# EAGLE schematic rotor (EAGLE 9.6.2)
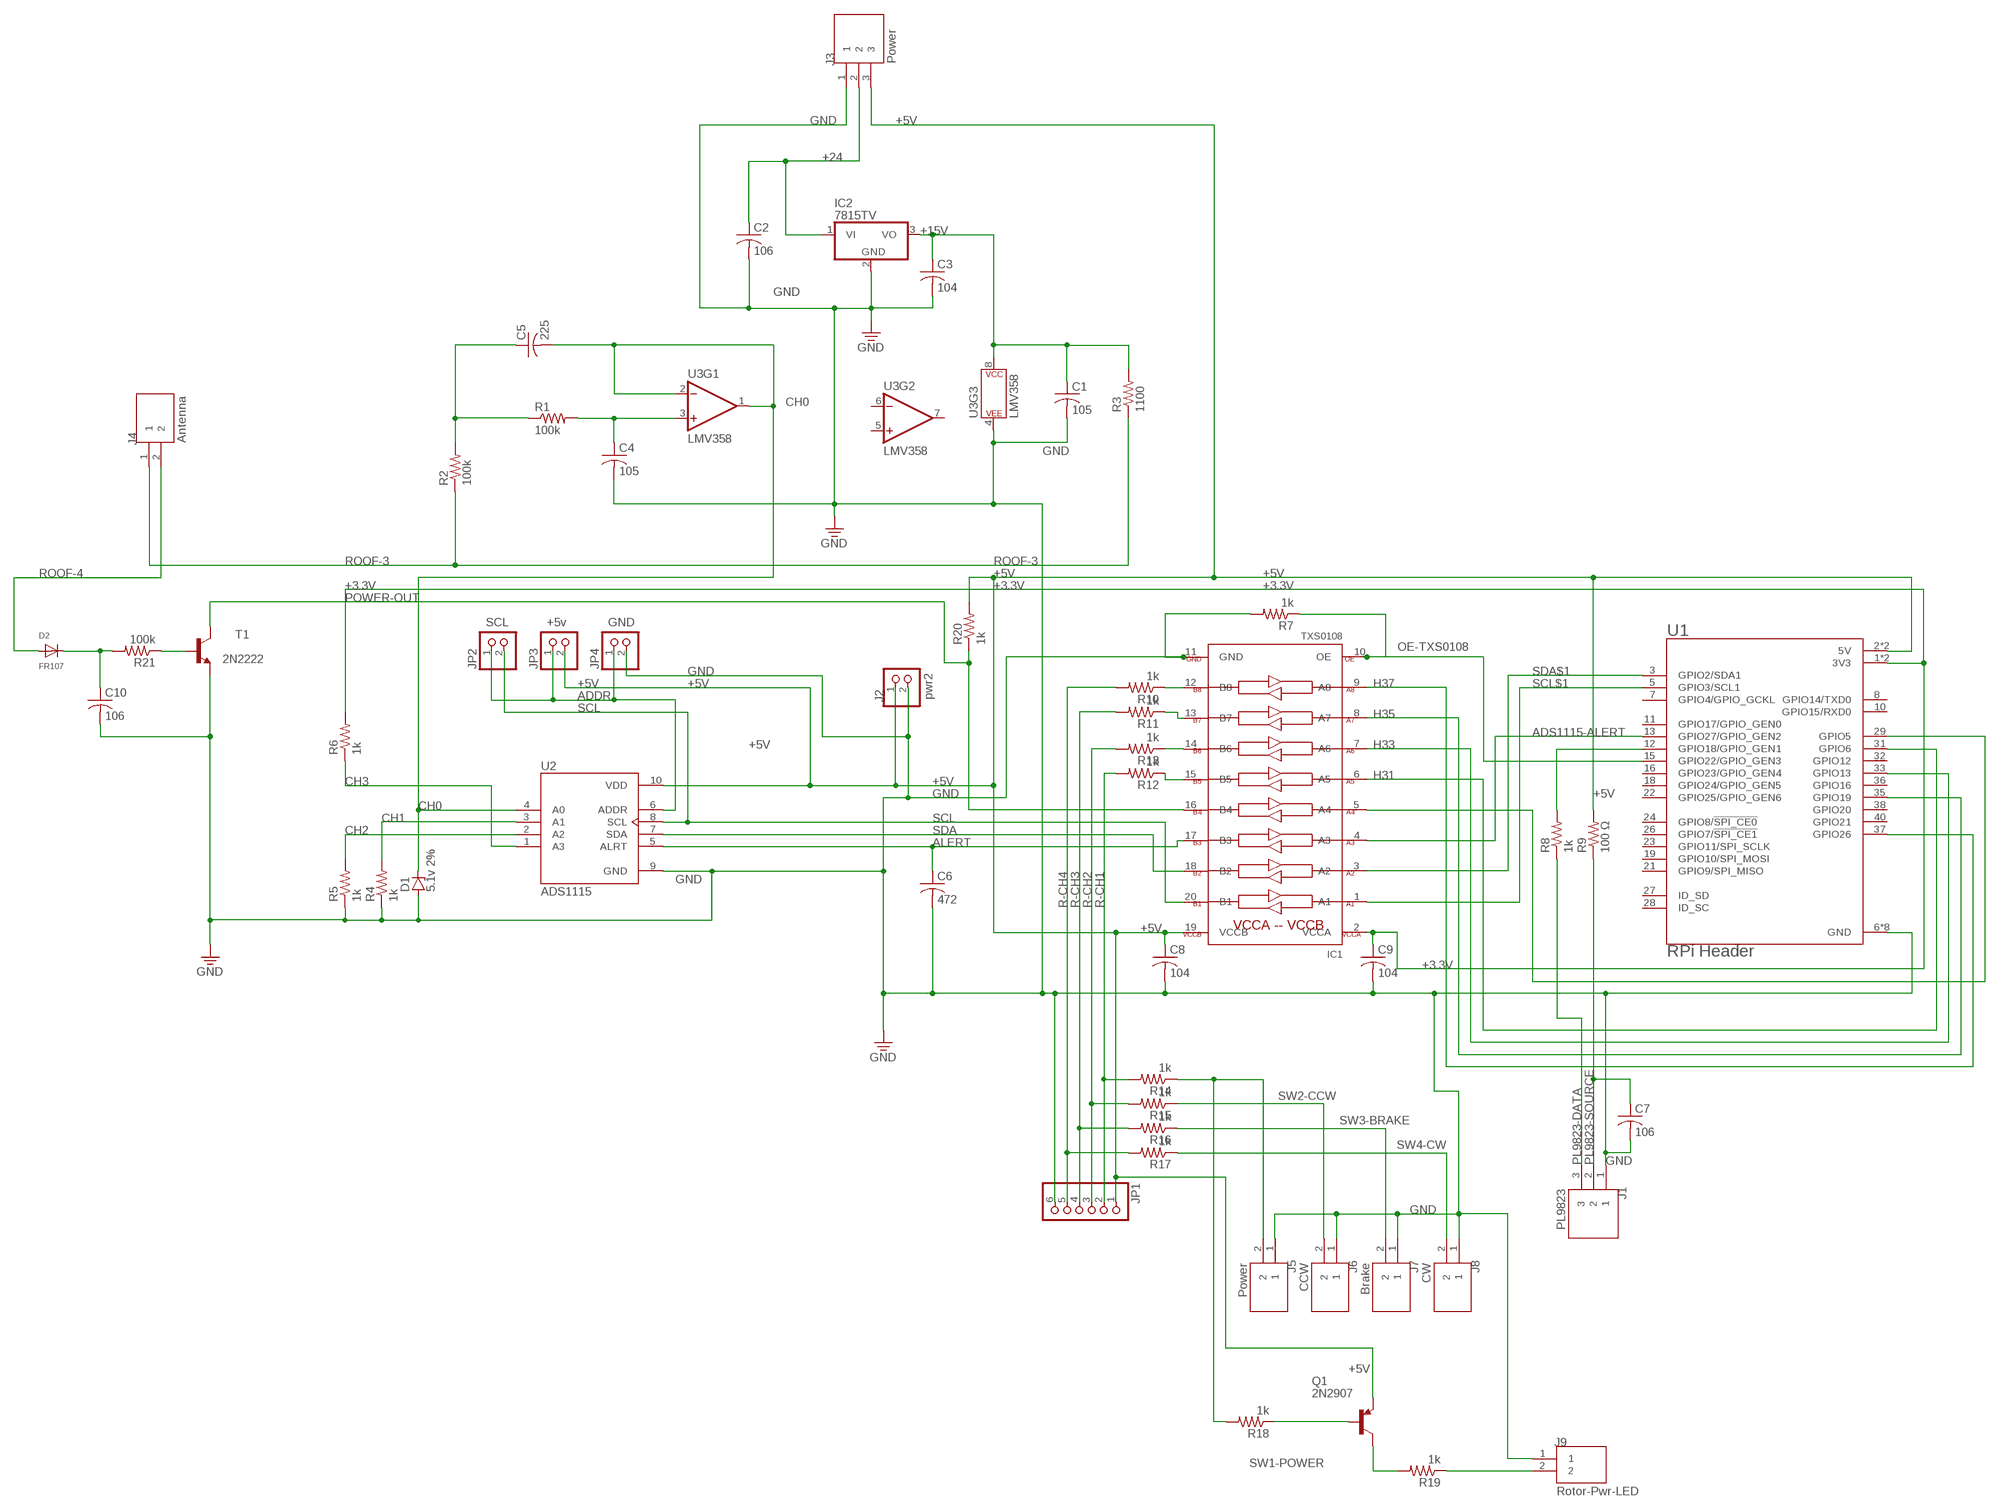
[diagram p0: schematic, sheet 1]

## Parts
C1  105  C-USC0805  [C0805]
C2  106  C-USC0805  [C0805]
C3  104  C-USC0805  [C0805]
C4  105  C-USC0805  [C0805]
C5  225  C-USC0805  [C0805]
C6  472  C-USC0805  [C0805]
C7  106  C-USC0805  [C0805]
C8  104  C-USC0805  [C0805]
C9  104  C-USC0805  [C0805]
C10  106  C-USC0805  [C0805]
D1  5.1v 2%  ZENER-DIODEZD-7.5  [ZDIO-7.5]
D2  FR107  DIODESMA  [SMADIODE]
IC1  TXS0108  TXS0108EPWR  [TSSOP20]
IC2  7815TV  [TO220V]
J1  PL9823  TB004-508-03BE  [CUI_TB004-508-03BE]
J2  pwr2  PINHD-1X2  [1X02]
J3  Power  TB004-508-03BE  [CUI_TB004-508-03BE]
J4  Antenna  TB004-508-02BE  [CUI_TB004-508-02BE]
J5  Power  TB004-508-02BE  [CUI_TB004-508-02BE]
J6  CCW  TB004-508-02BE  [CUI_TB004-508-02BE]
J7  Brake  TB004-508-02BE  [CUI_TB004-508-02BE]
J8  CW  TB004-508-02BE  [CUI_TB004-508-02BE]
J9  Rotor-Pwr-LED  TB004-508-02BE  [CUI_TB004-508-02BE]
JP1  PINHD-1X6  [1X06]
JP2  SCL  PINHD-1X2SPECIAL  [1X02-SPECIAL]
JP3  +5v  PINHD-1X2SPECIAL  [1X02-SPECIAL]
JP4  GND  PINHD-1X2SPECIAL  [1X02-SPECIAL]
Q1  2N2907  [TO92-EBC-OVAL]
R1  100k  R-US_M0805  [M0805]
R2  100k  R-US_M0805  [M0805]
R3  1100  R-US_0204/7  [0204/7]
R4  1k  R-US_M0805  [M0805]
R5  1k  R-US_M0805  [M0805]
R6  1k  R-US_M0805  [M0805]
R7  1k  R-US_M0805  [M0805]
R8  1k  R-US_M0805  [M0805]
R9  100 Ω  R-US_M0805  [M0805]
R10  1k  R-US_M0805  [M0805]
R11  1k  R-US_M0805  [M0805]
R12  1k  R-US_M0805  [M0805]
R13  1k  R-US_M0805  [M0805]
R14  1k  R-US_M0805  [M0805]
R15  1k  R-US_M0805  [M0805]
R16  1k  R-US_M0805  [M0805]
R17  1k  R-US_M0805  [M0805]
R18  1k  R-US_M0805  [M0805]
R19  1k  R-US_M0805  [M0805]
R20  1k  R-US_M0805  [M0805]
R21  100k  R-US_M0805  [M0805]
T1  2N2222  [TO92-EBC-OVAL]
U1  RPi Header  RASPBERRY_PI_3B+_HDRMODEL_RASPBEERY_PI_3B_HDR  [MODULE_RASPBERRY_PI_3B+_HDR]
U2  ADS1115  ADS1115-BREAKOUT-NARROW  [MODULE_1115_NARROW]
U3  LMV358  LM358-SOP8SOIC  [SO08]

## Nets
+3.3V: C9.1 IC1.2(VCCA) R6.2 U1.1(3V3) U1.17(3V3)
+5V: C8.1 IC1.19(VCCB) J2.1 J3.3 JP1.1 JP3.2 Q1.E R9.2 R20.2 U1.2(5V) U1.4(5V) U2.10(VDD)
+15V: C1.1 C3.1 IC2.3(VO) R3.2 U3.8(P$V+)
+24: C2.1 IC2.1(VI) J3.2
ADDR: JP2.1 JP3.1 JP4.1 U2.6(ADDR)
ADS1115-ALERT: IC1.4(A3) U1.13(GPIO27/GPIO_GEN2)
ALERT: C6.1 IC1.17(B3) U2.5(ALRT)
CH0: C5.2 D1.C U2.4(A0) U3.1(OUT) U3.2(-IN)
CH1: R4.2 U2.3(A1)
CH2: R5.2 U2.2(A2)
CH3: R6.1 U2.1(A3)
GND: C1.2 C2.2 C3.2 C4.2 C6.2 C7.2 C8.2 C9.2 C10.2 D1.A IC1.11(GND) IC2.2(GND) J1.1 J2.2 J3.1 J5.1 J6.1 J7.1 J8.1 J9.1 JP1.6 JP4.2 R4.1 R5.1 R7.2 T1.E U1.6(GND) U1.9(GND) U1.14(GND) U1.20(GND) U1.25(GND) U1.30(GND) U1.34(GND) U1.39(GND) U2.9(GND) U3.4(P$V-)
H31: IC1.6(A5) U1.31(GPIO6)
H33: IC1.7(A6) U1.33(GPIO13)
H35: IC1.8(A7) U1.35(GPIO19)
H37: IC1.9(A8) U1.37(GPIO26)
N$1: C4.1 R1.2 U3.3(+IN)
N$2: R8.2 U1.12(GPIO18/GPIO_GEN1)
N$3: C5.1 R1.1 R2.2
N$4: IC1.15(B5) R12.1
N$5: IC1.14(B6) R13.1
N$6: IC1.13(B7) R11.1
N$7: IC1.12(B8) R10.1
N$8: Q1.C R19.2
N$9: Q1.B R18.1
N$10: IC1.5(A4) U1.29(GPIO5)
N$11: C10.1 D2.C R21.2
N$12: R21.1 T1.B
OE-TXS0108: IC1.10(OE) R7.1 U1.15(GPIO22/GPIO_GEN3)
PL9823-DATA: J1.3 R8.1
PL9823-SOURCE: C7.1 J1.2 R9.1
POWER-OUT: IC1.16(B4) R20.1 T1.C
R-CH1: JP1.2 R12.2 R14.2
R-CH2: JP1.3 R13.2 R15.2
R-CH3: JP1.4 R11.2 R16.2
R-CH4: JP1.5 R10.2 R17.2
ROOF-3: J4.1 R2.1 R3.1
ROOF-4: D2.A J4.2
ROTOR-PWR-LED-SOURCE: J9.2 R19.1
SCL: IC1.20(B1) JP2.2 U2.8(SCL)
SCL$1: IC1.1(A1) U1.5(GPIO3/SCL1)
SDA: IC1.18(B2) U2.7(SDA)
SDA$1: IC1.3(A2) U1.3(GPIO2/SDA1)
SW1-POWER: J5.2 R14.1 R18.2
SW2-CCW: J6.2 R15.1
SW3-BRAKE: J7.2 R16.1
SW4-CW: J8.2 R17.1
Unconnected: U1.7(GPIO4/GPIO_GCKL) U1.8(GPIO14/TXD0) U1.10(GPIO15/RXD0) U1.11(GPIO17/GPIO_GEN0) U1.16(GPIO23/GPIO_GEN4) U1.18(GPIO24/GPIO_GEN5) U1.19(GPIO10/SPI_MOSI) U1.21(GPIO9/SPI_MISO) U1.22(GPIO25/GPIO_GEN6) U1.23(GPIO11/SPI_SCLK) U1.24(GPIO8/!SPI_CE0!) U1.26(GPIO7/!SPI_CE1!) U1.27(ID_SD) U1.28(ID_SC) U1.32(GPIO12) U1.36(GPIO16) U1.38(GPIO20) U1.40(GPIO21) U3.5(+IN) U3.6(-IN) U3.7(OUT)

## Library data of the parts
C1-C10 = test:C-US: CAPACITOR, American symbol
D1 = diode:ZENER-DIODE: Z-Diode
D2 = test:DIODE: Diode SMADIODE - SMA Surface Mount Package 20V 1A Schottky Diode Digikey: 641-1014-6-ND DO-1N4148 - Through Hole Small Current Diode SOD-123 20V 1 A (.5mV Vf) Schottky Diode - Digikey: MBRX120TPMSCT-ND SOD-323 10V 570mA (.38mV Vf, 3ns) Schottky Diode - Digikey: ZLLS410CT-ND SOD-523 30V 30mA Schottky Diode (RB751S-40TE61) - Digikey: RB751S-40TE61CT-ND SOT23-R/W - SOT23 Package (R = Solder Paste/Reflow Ovens, W = Hand-Soldering) BAT54Film 40V 300mA - Digikey: 497-7162-1-ND
IC1 = txs0108e:TXS0108E: TI TXS0108E Pegelwandler Check availability <https://pricing.snapeda.com/parts/TXS0108E/Texas%20Instruments/view-part?ref=eda>; AVAILABILITY: In Stock; DESCRIPTION: Voltage Level Translator Bidirectional 1 Circuit 8 Channel 60Mbps 20-VQFN (3.5x4.5); MF: Texas Instruments; MP: TXS0108E; PACKAGE: None; PRICE: None; PURCHASE-URL: https://pricing.snapeda.com/search/part/TXS0108E/?ref=eda
IC2 = linear:78*: Positive VOLTAGE REGULATOR Source: http://cache.national.com/ds/LM/LM78L05.pdf http://www.fairchildsemi.com/ds/LM/LM7805.pdf
J1 J3 = TB004-508-03BE:TB004-508-03BE: Screw Terminal 5.08 pitch Check availability <https://pricing.snapeda.com/parts/TB004%20-508-03BE/CUI%20Devices/view-part?ref=eda>; AVAILABILITY: In Stock; CUI_PURCHASE_URL: https://www.cuidevices.com/product/interconnect/connectors/terminal-blocks/tb004-508-series?utm_source=snapeda.com&utm_medium=referral&utm_campaign=snapedaBOM; DESCRIPTION: 2~24 Poles, Screw Type, Horizontal, 5.08 Pitch, 24~12 (AWG), Terminal Block Connector; MF: CUI Devices; MP: TB004 -508-03BE; PACKAGE: None; PRICE: None; PURCHASE-URL: https://pricing.snapeda.com/search/part/TB004 -508-03BE/?ref=eda
J2 JP2-JP4 = pinhead:PINHD-1X2: PIN HEADER
J4-J9 = TB004-508-02BE:TB004-508-02BE: Screw Terminal 5.08 pitch Check availability <https://pricing.snapeda.com/parts/TB004-508-02BE/CUI%20Devices/view-part?ref=eda>; AVAILABILITY: In Stock; CUI_PURCHASE_URL: https://www.cuidevices.com/product/interconnect/connectors/terminal-blocks/tb004-508-series?utm_source=snapeda.com&utm_medium=referral&utm_campaign=snapedaBOM; DESCRIPTION: 2~24 Poles, Screw Type, Horizontal, 5.08 Pitch, 24~12 (AWG), Terminal Block Connector; MF: CUI Devices; MP: TB004-508-02BE; PACKAGE: None; PRICE: None; PURCHASE-URL: https://pricing.snapeda.com/search/part/TB004-508-02BE/?ref=eda
JP1 = pinhead:PINHD-1X6: PIN HEADER
Q1 = test:2N2907*: PNP Transistor Big Oval pads
R1-R21 = test:R-US_: RESISTOR, American symbol
T1 = test:2N2222: NPN TRANSISTOR Big oval pads
U1 = raspberry_pi_3b:RASPBERRY_PI_3B+_HDR: Check availability <https://pricing.snapeda.com/parts/RASPBERRY%20PI%203%20MODEL%20B%2B/Raspberry%20Pi/view-part?ref=eda>
U2 = ads1115breakout-narrow:ADS1115-BREAKOUT-NARROW: ADS1115 - 16 Bit 860 Samples per Second Analog to Digital Converter (ADC) Evaluation Board Check availability <https://pricing.snapeda.com/parts/1085/Adafruit%20Industries/view-part?ref=eda>; AVAILABILITY: In Stock; DESCRIPTION: ADS1115 series 16 Bit 860 Samples per Second Analog to Digital Converter (ADC) Evaluation Board; MF: Adafruit Industries; MP: 1085; PACKAGE: None; PRICE: None; PURCHASE-URL: https://pricing.snapeda.com/search/part/1085/?ref=eda
U3 = SparkFun-IC-Amplifiers:LM358-SOP8: IC LMV358 DUAL OP AMP Jellybean rail-to-rail output op-amp SparkFun Products SparkFun PicoBoard <https://www.sparkfun.com/products/11888> (WIG-11888) SparkFun Vernier Interface Shield <https://www.sparkfun.com/products/12858> (DEV-12858) SparkFun Blynk Board - ESP8266 <https://www.sparkfun.com/products/13794> (WRL-13794) SparkFun Digital Sandbox <https://www.sparkfun.com/products/12651> (DEV-12651 RoHS); PROD_ID: IC-09657